# Altium schematic sheet SWD.SchDoc
size A4
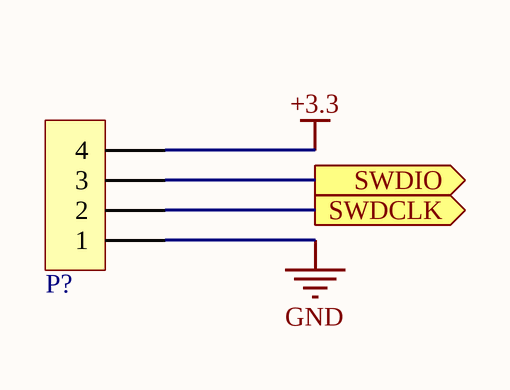
[diagram p0: SWD.SchDoc]

## Parts
P?  Header 4  [HDR4X1_A]  (value not drawn)

## Ports
SWDCLK (out), SWDIO (out)

## Nets
+3.3: P?.4
GND: P?.1
SWDCLK: P?.2 ; port SWDCLK
SWDIO: P?.3 ; port SWDIO

## Library data of the parts
P? = Header 4: 接插件; LatestRevisionDate: 17-Jul-2002; LatestRevisionNote: Re-released for DXP Platform.; Publisher: Altium Limited